# EAGLE schematic TEST BENCH (EAGLE 8.2.2)

## Sheet 1 of 5
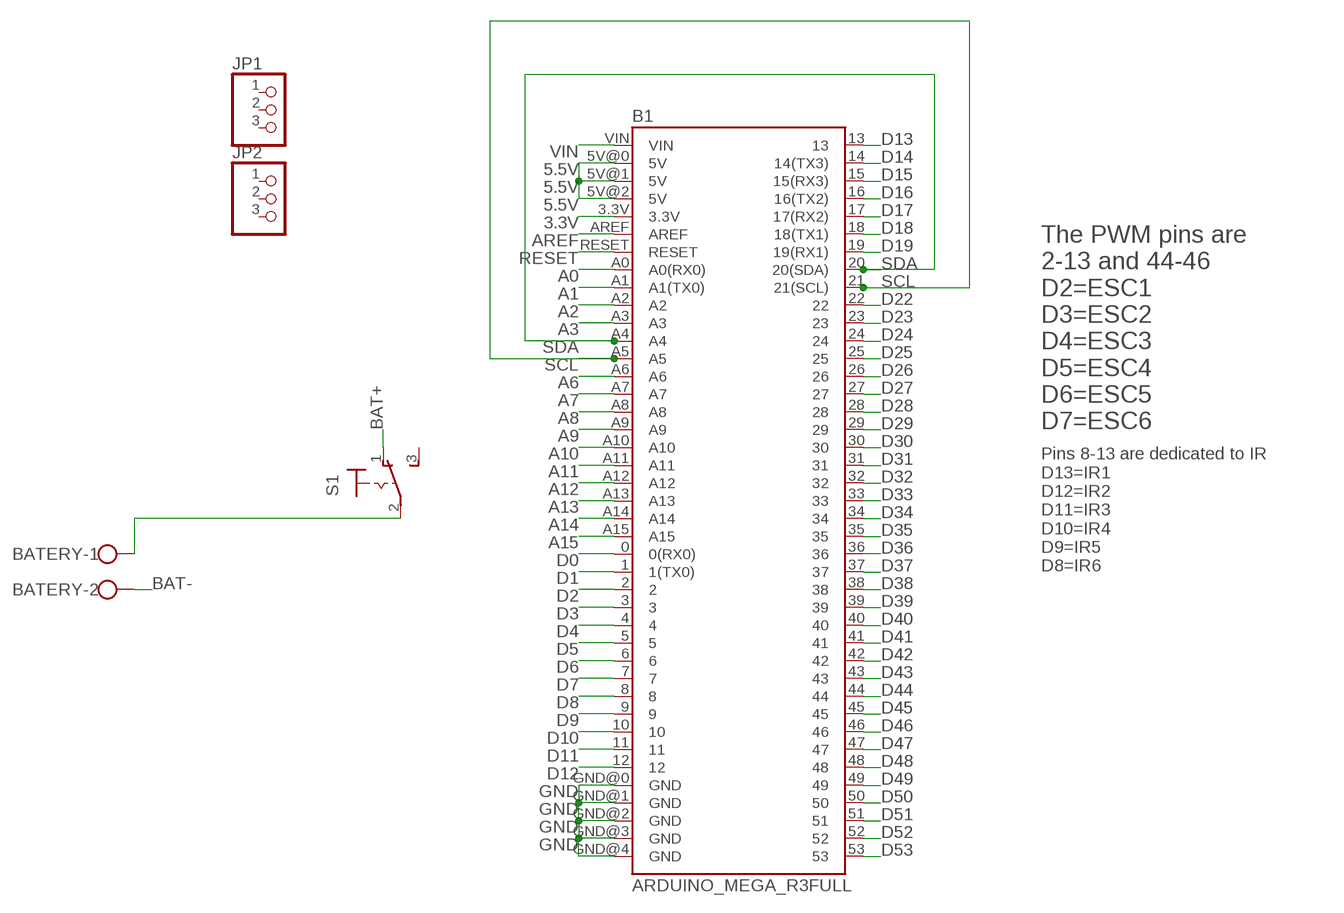
[diagram p0: schematic, sheet 1]

### Parts
B1  ARDUINO_MEGA_R3FULL  [ARDUINO_MEGA]
BATERY  W237-102  [W237-102]
JP1  PINHD-1X3  [1X03]
JP2  PINHD-1X3  [1X03]
S1  320-916  [320-916]

### Nets
3.3V: B1.3.3V ; also sheet 2
5.5V: B1.5V@0(5V) B1.5V@1(5V) B1.5V@2(5V) ; also sheet 2,5
A0: B1.A0(A0(RX0))
A1: B1.A1(A1(TX0))
A2: B1.A2
A3: B1.A3
A6: B1.A6
A7: B1.A7
A8: B1.A8
A9: B1.A9
A10: B1.A10
A11: B1.A11
A12: B1.A12
A13: B1.A13
A14: B1.A14
A15: B1.A15
AREF: B1.AREF
BAT+: S1.1(O) ; also sheet 4
BAT-: BATERY.2 ; also sheet 4
D0: B1.0(0(RX0))
D1: B1.1(1(TX0))
D2: B1.2 ; also sheet 4,5
D3: B1.3 ; also sheet 4,5
D4: B1.4 ; also sheet 4,5
D5: B1.5 ; also sheet 4,5
D6: B1.6 ; also sheet 4,5
D7: B1.7 ; also sheet 4,5
D8: B1.8 ; also sheet 2
D9: B1.9 ; also sheet 2
D10: B1.10 ; also sheet 2
D11: B1.11 ; also sheet 2
D12: B1.12 ; also sheet 2
D13: B1.13 ; also sheet 2
D14: B1.14(14(TX3))
D15: B1.15(15(RX3))
D16: B1.16(16(TX2))
D17: B1.17(17(RX2))
D18: B1.18(18(TX1))
D19: B1.19(19(RX1))
D22: B1.22
D23: B1.23
D24: B1.24
D25: B1.25
D26: B1.26
D27: B1.27
D28: B1.28
D29: B1.29
D30: B1.30
D31: B1.31
D32: B1.32
D33: B1.33
D34: B1.34
D35: B1.35
D36: B1.36
D37: B1.37
D38: B1.38
D39: B1.39
D40: B1.40
D41: B1.41
D42: B1.42
D43: B1.43
D44: B1.44
D45: B1.45
D46: B1.46
D47: B1.47
D48: B1.48
D49: B1.49
D50: B1.50
D51: B1.51
D52: B1.52
D53: B1.53
GND: B1.GND@0(GND) B1.GND@1(GND) B1.GND@2(GND) B1.GND@3(GND) B1.GND@4(GND) ; also sheet 2,3,4,5
N$4: BATERY.1 S1.2(P)
RESET: B1.RESET
SCL: B1.21(21(SCL)) B1.A5 ; also sheet 2,3
SDA: B1.20(20(SDA)) B1.A4 ; also sheet 2,3
VIN: B1.VIN ; also sheet 2,3,4
Unconnected: JP1.1 JP1.2 JP1.3 JP2.1 JP2.2 JP2.3 S1.3(S)

### Notes on the sheet
- The PWM pins are
  2-13 and 44-46
  D2=ESC1
  D3=ESC2
  D4=ESC3
  D5=ESC4
  D6=ESC5
  D7=ESC6
- Pins 8-13 are dedicated to IR
  D13=IR1
  D12=IR2
  D11=IR3
  D10=IR4
  D9=IR5
  D8=IR6

## Sheet 2 of 5
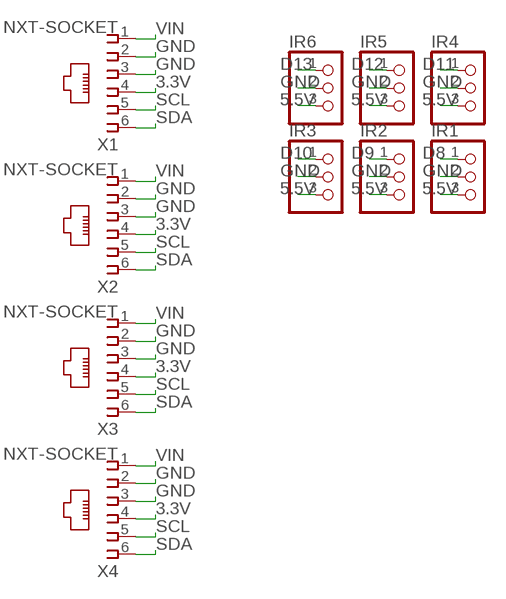
[diagram p1: schematic, sheet 2]

### Parts
IR1  PINHD-1X3  [1X03]
IR2  PINHD-1X3  [1X03]
IR3  PINHD-1X3  [1X03]
IR4  PINHD-1X3  [1X03]
IR5  PINHD-1X3  [1X03]
IR6  PINHD-1X3  [1X03]
X1  NXT-SOCKET  [NXT-SOCKET]
X2  NXT-SOCKET  [NXT-SOCKET]
X3  NXT-SOCKET  [NXT-SOCKET]
X4  NXT-SOCKET  [NXT-SOCKET]

### Nets
3.3V: X1.4 X2.4 X3.4 X4.4 ; also sheet 1
5.5V: IR1.3 IR2.3 IR3.3 IR4.3 IR5.3 IR6.3 ; also sheet 1,5
D8: IR1.1 ; also sheet 1
D9: IR2.1 ; also sheet 1
D10: IR3.1 ; also sheet 1
D11: IR4.1 ; also sheet 1
D12: IR5.1 ; also sheet 1
D13: IR6.1 ; also sheet 1
GND: IR1.2 IR2.2 IR3.2 IR4.2 IR5.2 IR6.2 X1.2 X1.3 X2.2 X2.3 X3.2 X3.3 X4.2 X4.3 ; also sheet 1,3,4,5
SCL: X1.5 X2.5 X3.5 X4.5 ; also sheet 1,3
SDA: X1.6 X2.6 X3.6 X4.6 ; also sheet 1,3
VIN: X1.1 X2.1 X3.1 X4.1 ; also sheet 1,3,4

## Sheet 3 of 5
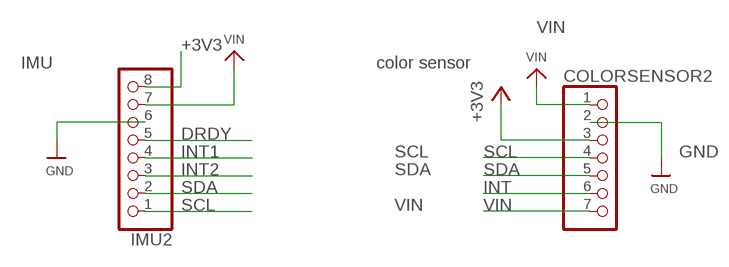
[diagram p2: schematic, sheet 3]

### Parts
COLORSENSOR2  HEADER-1X770MIL  [1X07_ROUND_70]
IMU2  HEADER-1X876MIL  [1X08_ROUND_76]

### Nets
+3V3: COLORSENSOR2.3 IMU2.8
DRDY: IMU2.5
GND: COLORSENSOR2.2 IMU2.6 ; also sheet 1,2,4,5
INT: COLORSENSOR2.6
INT1: IMU2.4
INT2: IMU2.3
SCL: COLORSENSOR2.4 IMU2.1 ; also sheet 1,2
SDA: COLORSENSOR2.5 IMU2.2 ; also sheet 1,2
VIN: COLORSENSOR2.1 COLORSENSOR2.7 IMU2.7 ; also sheet 1,2,4

### Notes on the sheet
- IMU | color sensor

## Sheet 4 of 5
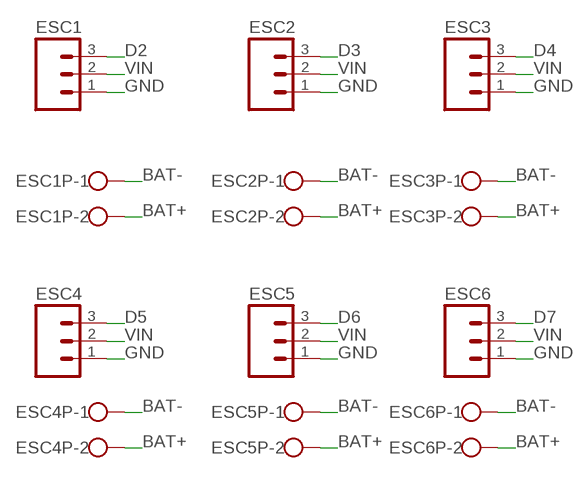
[diagram p3: schematic, sheet 4]

### Parts
ESC1  M03LOCK  [1X03_LOCK]
ESC1P  W237-102  [W237-102]
ESC2  M03LOCK  [1X03_LOCK]
ESC2P  W237-102  [W237-102]
ESC3  M03LOCK  [1X03_LOCK]
ESC3P  W237-102  [W237-102]
ESC4  M03LOCK  [1X03_LOCK]
ESC4P  W237-102  [W237-102]
ESC5  M03LOCK  [1X03_LOCK]
ESC5P  W237-102  [W237-102]
ESC6  M03LOCK  [1X03_LOCK]
ESC6P  W237-102  [W237-102]

### Nets
BAT+: ESC1P.2 ESC2P.2 ESC3P.2 ESC4P.2 ESC5P.2 ESC6P.2 ; also sheet 1
BAT-: ESC1P.1 ESC2P.1 ESC3P.1 ESC4P.1 ESC5P.1 ESC6P.1 ; also sheet 1
D2: ESC1.3 ; also sheet 1,5
D3: ESC2.3 ; also sheet 1,5
D4: ESC3.3 ; also sheet 1,5
D5: ESC4.3 ; also sheet 1,5
D6: ESC5.3 ; also sheet 1,5
D7: ESC6.3 ; also sheet 1,5
GND: ESC1.1 ESC2.1 ESC3.1 ESC4.1 ESC5.1 ESC6.1 ; also sheet 1,2,3,5
VIN: ESC1.2 ESC2.2 ESC3.2 ESC4.2 ESC5.2 ESC6.2 ; also sheet 1,2,3

## Sheet 5 of 5
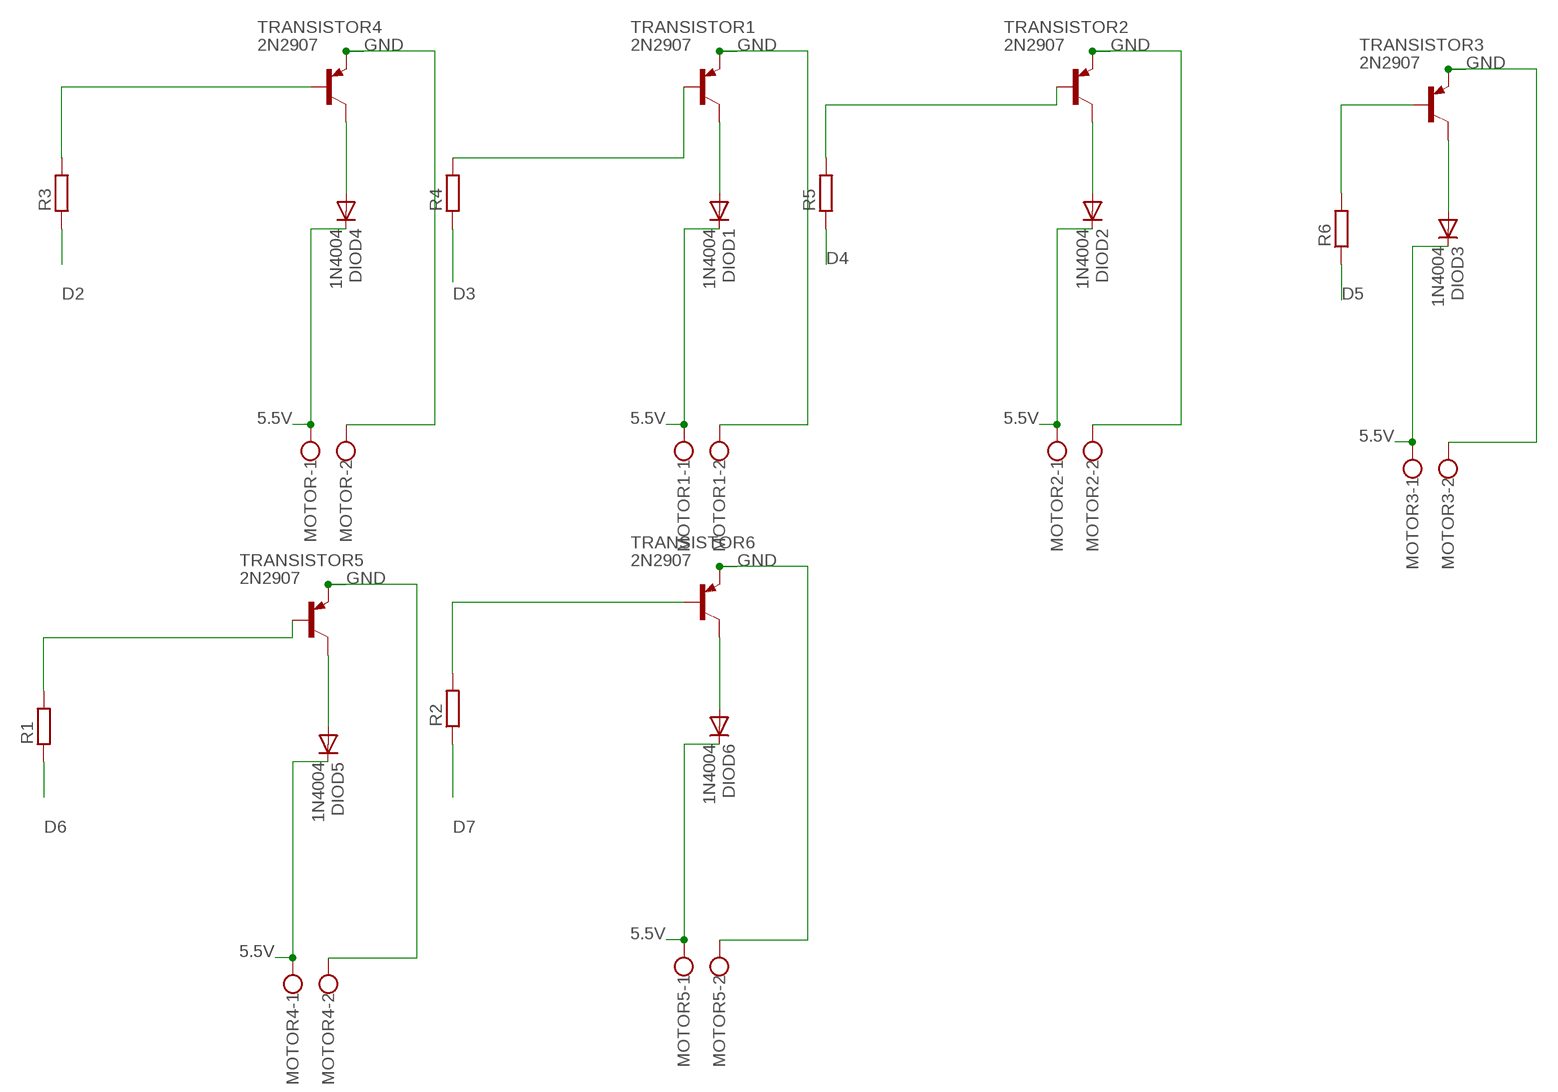
[diagram p4: schematic, sheet 5]

### Parts
DIOD1  1N4004  [DO41-10]
DIOD2  1N4004  [DO41-10]
DIOD3  1N4004  [DO41-10]
DIOD4  1N4004  [DO41-10]
DIOD5  1N4004  [DO41-10]
DIOD6  1N4004  [DO41-10]
MOTOR  W237-102  [W237-102]
MOTOR1  W237-102  [W237-102]
MOTOR2  W237-102  [W237-102]
MOTOR3  W237-102  [W237-102]
MOTOR4  W237-102  [W237-102]
MOTOR5  W237-102  [W237-102]
R1  RESISTOR  [R0603]
R2  RESISTOR  [R0603]
R3  RESISTOR  [R0603]
R4  RESISTOR  [R0603]
R5  RESISTOR  [R0603]
R6  RESISTOR  [R0603]
TRANSISTOR1  2N2907  [TO92-EBC-OVAL]
TRANSISTOR2  2N2907  [TO92-EBC-OVAL]
TRANSISTOR3  2N2907  [TO92-EBC-OVAL]
TRANSISTOR4  2N2907  [TO92-EBC-OVAL]
TRANSISTOR5  2N2907  [TO92-EBC-OVAL]
TRANSISTOR6  2N2907  [TO92-EBC-OVAL]

### Nets
5.5V: DIOD1.C DIOD2.C DIOD3.C DIOD4.C DIOD5.C DIOD6.C MOTOR1.1 MOTOR2.1 MOTOR3.1 MOTOR4.1 MOTOR5.1 MOTOR.1 ; also sheet 1,2
D2: R3.1 ; also sheet 1,4
D3: R4.1 ; also sheet 1,4
D4: R5.1 ; also sheet 1,4
D5: R6.1 ; also sheet 1,4
D6: R1.1 ; also sheet 1,4
D7: R2.1 ; also sheet 1,4
GND: MOTOR1.2 MOTOR2.2 MOTOR3.2 MOTOR4.2 MOTOR5.2 MOTOR.2 TRANSISTOR1.E TRANSISTOR2.E TRANSISTOR3.E TRANSISTOR4.E TRANSISTOR5.E TRANSISTOR6.E ; also sheet 1,2,3,4
N$1: R4.2 TRANSISTOR1.B
N$2: DIOD1.A TRANSISTOR1.C
N$3: R3.2 TRANSISTOR4.B
N$5: R5.2 TRANSISTOR2.B
N$6: DIOD2.A TRANSISTOR2.C
N$7: R6.2 TRANSISTOR3.B
N$8: DIOD3.A TRANSISTOR3.C
N$9: R1.2 TRANSISTOR5.B
N$10: DIOD5.A TRANSISTOR5.C
N$11: DIOD4.A TRANSISTOR4.C
N$12: R2.2 TRANSISTOR6.B
N$13: DIOD6.A TRANSISTOR6.C

## Library data of the parts
B1 = SparkFun-Boards:ARDUINO_MEGA_R3: Arduino Mega R3 ATmega2560 R3 compatible footprint. SparkFun Products: Arduino Mega 2560 R3 <https://www.sparkfun.com/products/11061>; MPN: A000067; OC_NEWARK: 45W6205
BATERY ESC1P ESC2P ESC3P ESC4P ESC5P ESC6P MOTOR MOTOR1-MOTOR5 = con-wago-500:W237-102: WAGO SCREW CLAMP; MPN: MA522-500M02; OC_FARNELL: unknown; OC_NEWARK: 04R6830
COLORSENSOR2 = microbuilder:HEADER-1X7: PIN HEADER; OC_NEWARK: unknown
DIOD1-DIOD6 = adafruit:1N4004: DIODE General purpose 1N400x type rectifier (With bigger pads) http://www.ladyada.net/library/pcb/eaglelibrary.html; MPN: 1N4004-T; OC_NEWARK: 12T2303
ESC1-ESC6 = SparkFun:M03: Header 3 Standard 3-pin 0.1" header. Use with straight break away headers (SKU : PRT-00116), right angle break away headers (PRT-00553), swiss pins (PRT-00743), machine pins (PRT-00117), and female headers (PRT-00115). Molex polarized connector foot print use with SKU : PRT-08232 with associated crimp pins and housings.; MF: MOLEX; MPN: 22-11-2032; OC_NEWARK: 81C8218
IMU2 = microbuilder:HEADER-1X8: PIN HEADER; OC_NEWARK: unknown
IR1-IR6 JP1 JP2 = adafruit:PINHD-1X3: PIN HEADER; OC_NEWARK: unknown
R1-R6 = BaseApp:RESISTOR: Resistance Package :- 0603 Mount :-Surface mount; MF: BOURNS, INC.; MPN: CR0603-FX-2700GLF; OC_NEWARK: 32K2331
S1 = switch:320-916: TOGGLE SWITCH distributor RS Components; MPN: 5636A9; OC_NEWARK: 13M4539
TRANSISTOR1-TRANSISTOR6 = adafruit:2N2907*: PNP Transistor Big Oval pads; MPN: PN2222ATF; OC_NEWARK: 29X6831
X1-X4 = NXT Compatible (female) Sockets - Mindsensors:NXT-SOCKET: RJ11 6 connects Manufacturer: Mindsensors.com Source: NXT-Female-Socket.pdf; MPN: RJE01-660-01; OC_FARNELL: unknown; OC_NEWARK: 01M6133